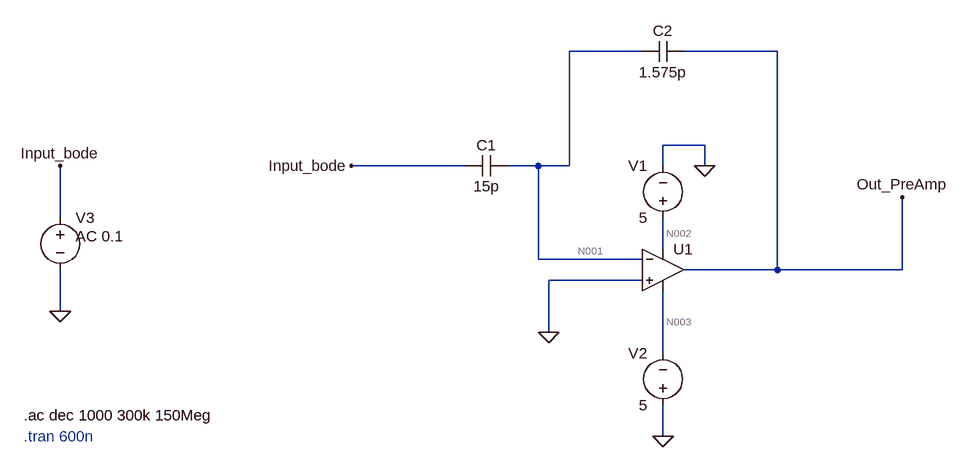
[diagram p0: schematic Draft1.asc]
Draft1.asc, the LTspice schematic file:
Version 4
SHEET 1 880 680
WIRE 288 -192 176 -192
WIRE 496 -192 352 -192
WIRE 384 -48 320 -48
WIRE 16 -16 -160 -16
WIRE 128 -16 80 -16
WIRE 176 -16 176 -192
WIRE 176 -16 128 -16
WIRE 320 -16 320 -48
WIRE 384 -16 384 -48
WIRE -608 64 -608 -16
WIRE 320 112 320 64
WIRE 128 128 128 -16
WIRE 288 128 128 128
WIRE 496 144 496 -192
WIRE 496 144 352 144
WIRE 688 144 688 32
WIRE 688 144 496 144
WIRE 288 160 144 160
WIRE -608 208 -608 144
WIRE 144 240 144 160
WIRE 320 272 320 176
WIRE 320 400 320 352
FLAG -608 208 0
FLAG -608 -16 Input_bode
FLAG 320 400 0
FLAG 384 -16 0
FLAG 144 240 0
FLAG 688 32 Out_PreAmp
FLAG -160 -16 Input_bode
SYMBOL voltage 320 80 R180
WINDOW 0 24 96 Left 2
WINDOW 3 24 16 Left 2
WINDOW 123 0 0 Left 0
WINDOW 39 0 0 Left 0
SYMATTR InstName V1
SYMATTR Value 5
SYMBOL voltage 320 368 R180
WINDOW 0 24 96 Left 2
WINDOW 3 24 16 Left 2
WINDOW 123 0 0 Left 0
WINDOW 39 0 0 Left 0
SYMATTR InstName V2
SYMATTR Value 5
SYMBOL OpAmps\\UniversalOpAmp1 320 144 R0
SYMATTR InstName U1
SYMATTR Value2 Avol=1Meg GBW=100Meg Vos=0
SYMBOL voltage -608 48 R0
WINDOW 123 24 44 Left 2
WINDOW 39 0 0 Left 0
SYMATTR Value2 AC 0.1
SYMATTR InstName V3
SYMATTR Value ""
SYMBOL cap 80 -32 R90
WINDOW 0 0 32 VBottom 2
WINDOW 3 32 32 VTop 2
SYMATTR InstName C1
SYMATTR Value 15p
SYMBOL cap 352 -208 R90
WINDOW 0 0 32 VBottom 2
WINDOW 3 32 32 VTop 2
SYMATTR InstName C2
SYMATTR Value 1.575p
TEXT -664 400 Left 2 ;.tran 600n
TEXT -664 368 Left 2 !.ac dec 1000 300k 150Meg

The netlist it stands for:
* Draft1.asc
V1 N002 0 5
V2 0 N003 5
XU1 0 N001 N002 N003 Out_PreAmp level1 Avol=1Meg GBW=100Meg Vos=0 En=0 Enk=0 In=0 Ink=0 Rin=500Meg  ; pins In+ In- V+ V- OUT
V3 Input_bode 0 AC 0.1
C1 N001 Input_bode 15p
C2 Out_PreAmp N001 1.575p
* .tran 600n
.ac dec 1000 300k 150Meg
.lib UniversalOpAmp1.lib
.backanno
.end

* Results of the author's LTspice run, read from the files saved beside the schematic
* Operating Point, zero values left out:
*   V(n002) = 5 V
*   V(n003) = -5 V
*   I(V1) = -10 nA
*   I(V2) = -10 nA
*   Ix(u1:3) = 10 nA
*   Ix(u1:4) = -10 nA
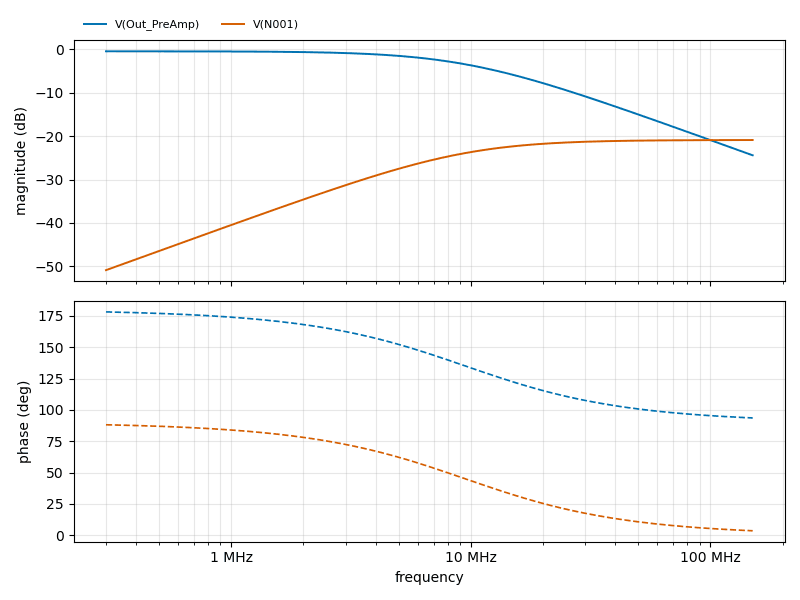
[diagram p1: AC Analysis of Draft1.asc, plotted from the saved traces]
* AC Analysis, 1 run:
*   V(Out_PreAmp): -0.43 dB at 300 kHz, -24.41 dB at 150 MHz, peak -0.43 dB at 300 kHz, 3 dB below the peak at 9.512 MHz
*   V(N001): -50.89 dB at 300 kHz, -20.88 dB at 150 MHz, peak -20.88 dB at 150 MHz, 3 dB below the peak at 9.464 MHz